# EAGLE design Debug_Phantom_V2 (EAGLE 7.2.0)
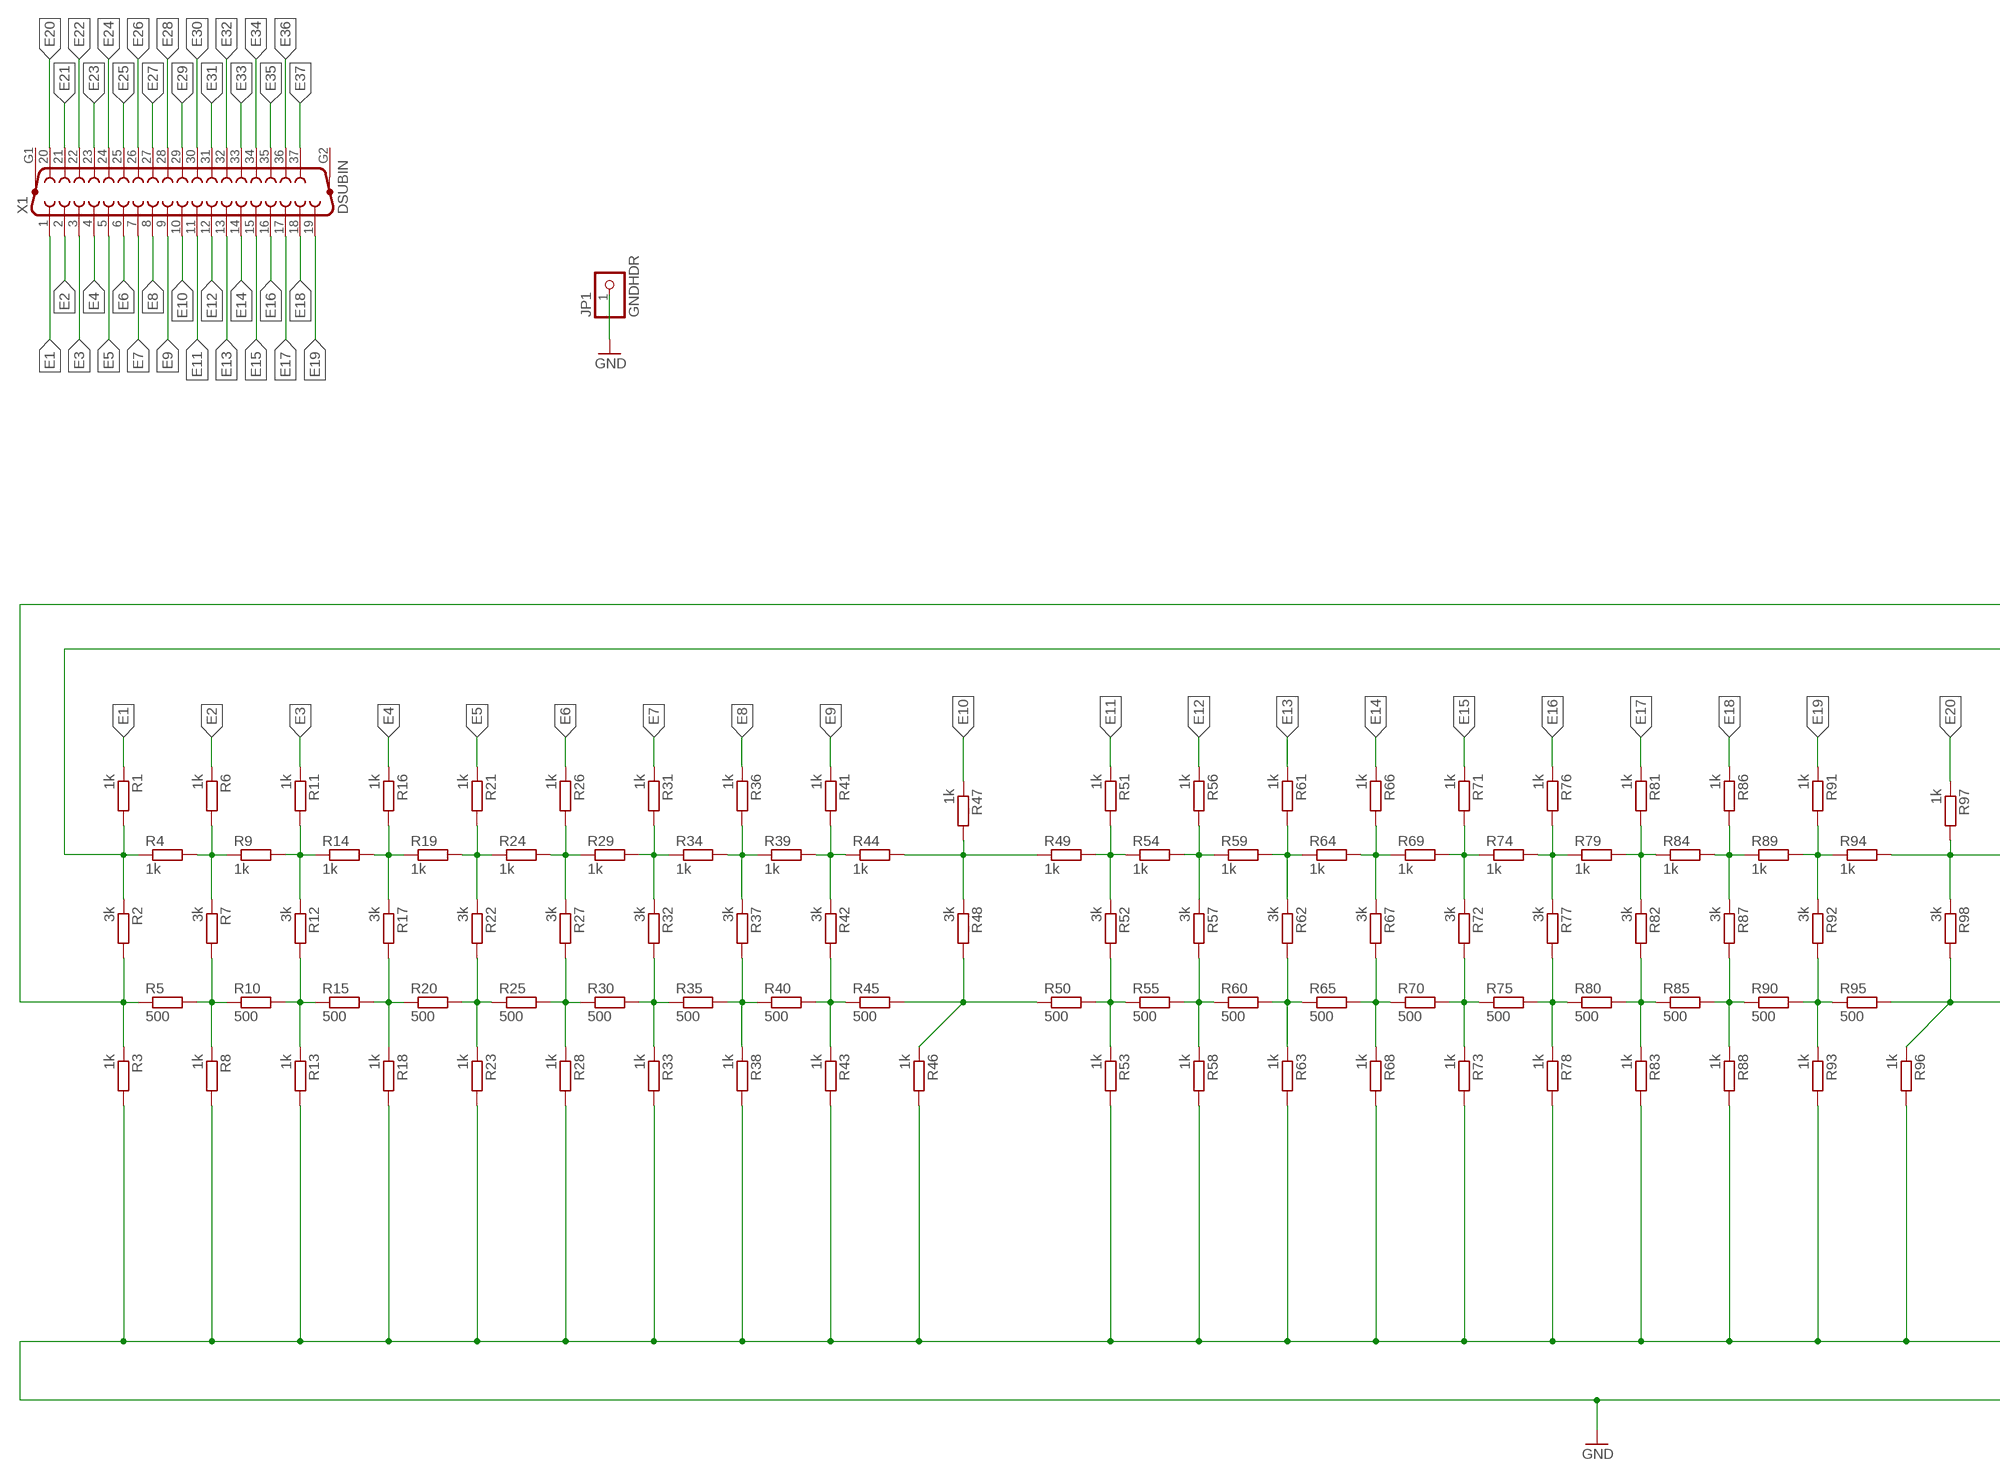
[diagram p0: schematic, sheet 1, part 1 of 2]
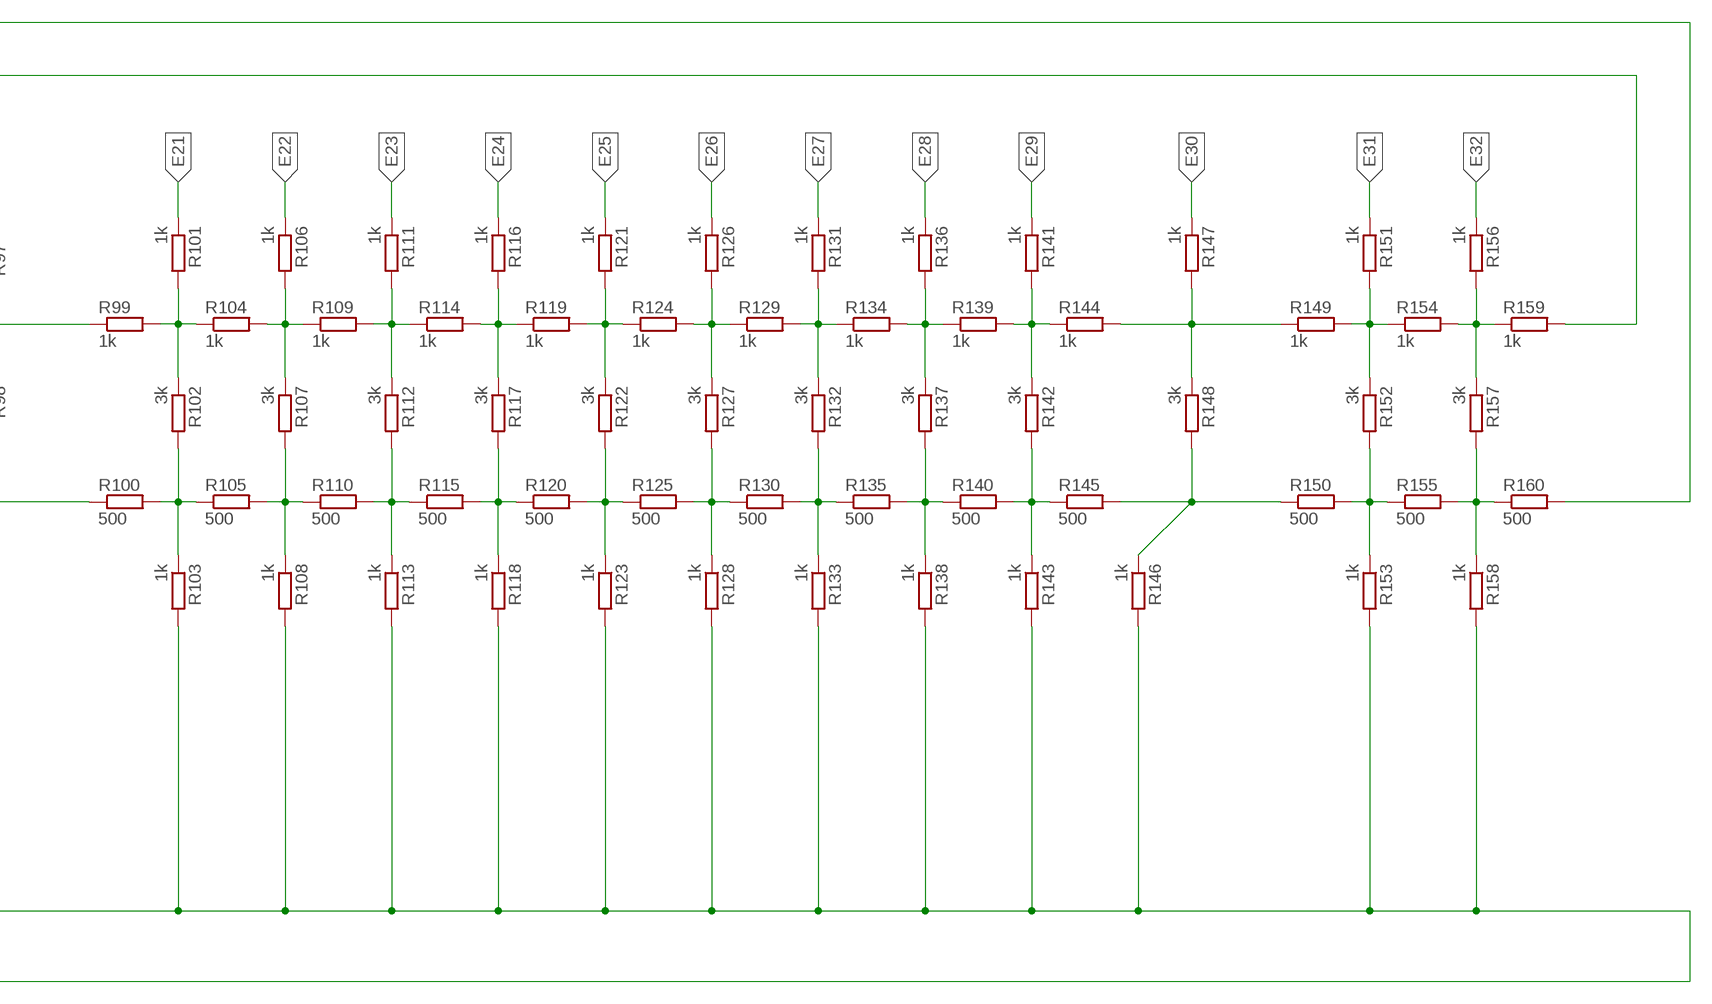
[diagram p1: schematic, sheet 1, part 2 of 2]

## Parts
JP1  GNDHDR  PINHD-1X1  [1X01]
R1  1k  R-EU_R0402  [R0402]
R2  3k  R-EU_R0402  [R0402]
R3  1k  R-EU_R0402  [R0402]
R4  1k  R-EU_R0402  [R0402]
R5  500  R-EU_R0402  [R0402]
R6  1k  R-EU_R0402  [R0402]
R7  3k  R-EU_R0402  [R0402]
R8  1k  R-EU_R0402  [R0402]
R9  1k  R-EU_R0402  [R0402]
R10  500  R-EU_R0402  [R0402]
R11  1k  R-EU_R0402  [R0402]
R12  3k  R-EU_R0402  [R0402]
R13  1k  R-EU_R0402  [R0402]
R14  1k  R-EU_R0402  [R0402]
R15  500  R-EU_R0402  [R0402]
R16  1k  R-EU_R0402  [R0402]
R17  3k  R-EU_R0402  [R0402]
R18  1k  R-EU_R0402  [R0402]
R19  1k  R-EU_R0402  [R0402]
R20  500  R-EU_R0402  [R0402]
R21  1k  R-EU_R0402  [R0402]
R22  3k  R-EU_R0402  [R0402]
R23  1k  R-EU_R0402  [R0402]
R24  1k  R-EU_R0402  [R0402]
R25  500  R-EU_R0402  [R0402]
R26  1k  R-EU_R0402  [R0402]
R27  3k  R-EU_R0402  [R0402]
R28  1k  R-EU_R0402  [R0402]
R29  1k  R-EU_R0402  [R0402]
R30  500  R-EU_R0402  [R0402]
R31  1k  R-EU_R0402  [R0402]
R32  3k  R-EU_R0402  [R0402]
R33  1k  R-EU_R0402  [R0402]
R34  1k  R-EU_R0402  [R0402]
R35  500  R-EU_R0402  [R0402]
R36  1k  R-EU_R0402  [R0402]
R37  3k  R-EU_R0402  [R0402]
R38  1k  R-EU_R0402  [R0402]
R39  1k  R-EU_R0402  [R0402]
R40  500  R-EU_R0402  [R0402]
R41  1k  R-EU_R0402  [R0402]
R42  3k  R-EU_R0402  [R0402]
R43  1k  R-EU_R0402  [R0402]
R44  1k  R-EU_R0402  [R0402]
R45  500  R-EU_R0402  [R0402]
R46  1k  R-EU_R0402  [R0402]
R47  1k  R-EU_R0402  [R0402]
R48  3k  R-EU_R0402  [R0402]
R49  1k  R-EU_R0402  [R0402]
R50  500  R-EU_R0402  [R0402]
R51  1k  R-EU_R0402  [R0402]
R52  3k  R-EU_R0402  [R0402]
R53  1k  R-EU_R0402  [R0402]
R54  1k  R-EU_R0402  [R0402]
R55  500  R-EU_R0402  [R0402]
R56  1k  R-EU_R0402  [R0402]
R57  3k  R-EU_R0402  [R0402]
R58  1k  R-EU_R0402  [R0402]
R59  1k  R-EU_R0402  [R0402]
R60  500  R-EU_R0402  [R0402]
R61  1k  R-EU_R0402  [R0402]
R62  3k  R-EU_R0402  [R0402]
R63  1k  R-EU_R0402  [R0402]
R64  1k  R-EU_R0402  [R0402]
R65  500  R-EU_R0402  [R0402]
R66  1k  R-EU_R0402  [R0402]
R67  3k  R-EU_R0402  [R0402]
R68  1k  R-EU_R0402  [R0402]
R69  1k  R-EU_R0402  [R0402]
R70  500  R-EU_R0402  [R0402]
R71  1k  R-EU_R0402  [R0402]
R72  3k  R-EU_R0402  [R0402]
R73  1k  R-EU_R0402  [R0402]
R74  1k  R-EU_R0402  [R0402]
R75  500  R-EU_R0402  [R0402]
R76  1k  R-EU_R0402  [R0402]
R77  3k  R-EU_R0402  [R0402]
R78  1k  R-EU_R0402  [R0402]
R79  1k  R-EU_R0402  [R0402]
R80  500  R-EU_R0402  [R0402]
R81  1k  R-EU_R0402  [R0402]
R82  3k  R-EU_R0402  [R0402]
R83  1k  R-EU_R0402  [R0402]
R84  1k  R-EU_R0402  [R0402]
R85  500  R-EU_R0402  [R0402]
R86  1k  R-EU_R0402  [R0402]
R87  3k  R-EU_R0402  [R0402]
R88  1k  R-EU_R0402  [R0402]
R89  1k  R-EU_R0402  [R0402]
R90  500  R-EU_R0402  [R0402]
R91  1k  R-EU_R0402  [R0402]
R92  3k  R-EU_R0402  [R0402]
R93  1k  R-EU_R0402  [R0402]
R94  1k  R-EU_R0402  [R0402]
R95  500  R-EU_R0402  [R0402]
R96  1k  R-EU_R0402  [R0402]
R97  1k  R-EU_R0402  [R0402]
R98  3k  R-EU_R0402  [R0402]
R99  1k  R-EU_R0402  [R0402]
R100  500  R-EU_R0402  [R0402]
R101  1k  R-EU_R0402  [R0402]
R102  3k  R-EU_R0402  [R0402]
R103  1k  R-EU_R0402  [R0402]
R104  1k  R-EU_R0402  [R0402]
R105  500  R-EU_R0402  [R0402]
R106  1k  R-EU_R0402  [R0402]
R107  3k  R-EU_R0402  [R0402]
R108  1k  R-EU_R0402  [R0402]
R109  1k  R-EU_R0402  [R0402]
R110  500  R-EU_R0402  [R0402]
R111  1k  R-EU_R0402  [R0402]
R112  3k  R-EU_R0402  [R0402]
R113  1k  R-EU_R0402  [R0402]
R114  1k  R-EU_R0402  [R0402]
R115  500  R-EU_R0402  [R0402]
R116  1k  R-EU_R0402  [R0402]
R117  3k  R-EU_R0402  [R0402]
R118  1k  R-EU_R0402  [R0402]
R119  1k  R-EU_R0402  [R0402]
R120  500  R-EU_R0402  [R0402]
R121  1k  R-EU_R0402  [R0402]
R122  3k  R-EU_R0402  [R0402]
R123  1k  R-EU_R0402  [R0402]
R124  1k  R-EU_R0402  [R0402]
R125  500  R-EU_R0402  [R0402]
R126  1k  R-EU_R0402  [R0402]
R127  3k  R-EU_R0402  [R0402]
R128  1k  R-EU_R0402  [R0402]
R129  1k  R-EU_R0402  [R0402]
R130  500  R-EU_R0402  [R0402]
R131  1k  R-EU_R0402  [R0402]
R132  3k  R-EU_R0402  [R0402]
R133  1k  R-EU_R0402  [R0402]
R134  1k  R-EU_R0402  [R0402]
R135  500  R-EU_R0402  [R0402]
R136  1k  R-EU_R0402  [R0402]
R137  3k  R-EU_R0402  [R0402]
R138  1k  R-EU_R0402  [R0402]
R139  1k  R-EU_R0402  [R0402]
R140  500  R-EU_R0402  [R0402]
R141  1k  R-EU_R0402  [R0402]
R142  3k  R-EU_R0402  [R0402]
R143  1k  R-EU_R0402  [R0402]
R144  1k  R-EU_R0402  [R0402]
R145  500  R-EU_R0402  [R0402]
R146  1k  R-EU_R0402  [R0402]
R147  1k  R-EU_R0402  [R0402]
R148  3k  R-EU_R0402  [R0402]
R149  1k  R-EU_R0402  [R0402]
R150  500  R-EU_R0402  [R0402]
R151  1k  R-EU_R0402  [R0402]
R152  3k  R-EU_R0402  [R0402]
R153  1k  R-EU_R0402  [R0402]
R154  1k  R-EU_R0402  [R0402]
R155  500  R-EU_R0402  [R0402]
R156  1k  R-EU_R0402  [R0402]
R157  3k  R-EU_R0402  [R0402]
R158  1k  R-EU_R0402  [R0402]
R159  1k  R-EU_R0402  [R0402]
R160  500  R-EU_R0402  [R0402]
X1  DSUBIN  F37VP  [F37VP]

## Nets
E1: R1.1 X1.1
E2: R6.1 X1.2
E3: R11.1 X1.3
E4: R16.1 X1.4
E5: R21.1 X1.5
E6: R26.1 X1.6
E7: R31.1 X1.7
E8: R36.1 X1.8
E9: R41.1 X1.9
E10: R47.1 X1.10
E11: R51.1 X1.11
E12: R56.1 X1.12
E13: R61.1 X1.13
E14: R66.1 X1.14
E15: R71.1 X1.15
E16: R76.1 X1.16
E17: R81.1 X1.17
E18: R86.1 X1.18
E19: R91.1 X1.19
E20: R97.1 X1.20
E21: R101.1 X1.21
E22: R106.1 X1.22
E23: R111.1 X1.23
E24: R116.1 X1.24
E25: R121.1 X1.25
E26: R126.1 X1.26
E27: R131.1 X1.27
E28: R136.1 X1.28
E29: R141.1 X1.29
E30: R147.1 X1.30
E31: R151.1 X1.31
E32: R156.1 X1.32
E33: X1.33
E34: X1.34
E35: X1.35
E36: X1.36
E37: X1.37
E38: R1.2 R2.1 R4.1 R159.2
E39: R4.2 R6.2 R7.1 R9.1
E40: R9.2 R11.2 R12.1 R14.1
E41: R14.2 R16.2 R17.1 R19.1
E42: R19.2 R21.2 R22.1 R24.1
E43: R24.2 R26.2 R27.1 R29.1
E44: R29.2 R31.2 R32.1 R34.1
E45: R34.2 R36.2 R37.1 R39.1
E46: R39.2 R41.2 R42.1 R44.1
E47: R44.2 R47.2 R48.1 R49.1
E48: R49.2 R51.2 R52.1 R54.1
E49: R54.2 R56.2 R57.1 R59.1
E50: R59.2 R61.2 R62.1 R64.1
E51: R64.2 R66.2 R67.1 R69.1
E52: R69.2 R71.2 R72.1 R74.1
E53: R74.2 R76.2 R77.1 R79.1
E54: R79.2 R81.2 R82.1 R84.1
E55: R84.2 R86.2 R87.1 R89.1
E56: R89.2 R91.2 R92.1 R94.1
E57: R94.2 R97.2 R98.1 R99.1
E58: R99.2 R101.2 R102.1 R104.1
E59: R104.2 R106.2 R107.1 R109.1
E60: R109.2 R111.2 R112.1 R114.1
E61: R114.2 R116.2 R117.1 R119.1
E63: R124.2 R126.2 R127.1 R129.1
E64: R129.2 R131.2 R132.1 R134.1
E65: R134.2 R136.2 R137.1 R139.1
E66: R139.2 R141.2 R142.1 R144.1
E67: R144.2 R147.2 R148.1 R149.1
E68: R149.2 R151.2 R152.1 R154.1
E69: R154.2 R156.2 R157.1 R159.1
GND: JP1.1 R3.2 R8.2 R13.2 R18.2 R23.2 R28.2 R33.2 R38.2 R43.2 R46.2 R53.2 R58.2 R63.2 R68.2 R73.2 R78.2 R83.2 R88.2 R93.2 R96.2 R103.2 R108.2 R113.2 R118.2 R123.2 R128.2 R133.2 R138.2 R143.2 R146.2 R153.2 R158.2
N$1: R119.2 R121.2 R122.1 R124.1
N$2: R2.2 R3.1 R5.1 R160.2
N$3: R5.2 R7.2 R8.1 R10.1
N$4: R10.2 R12.2 R13.1 R15.1
N$5: R15.2 R17.2 R18.1 R20.1
N$6: R20.2 R22.2 R23.1 R25.1
N$7: R25.2 R27.2 R28.1 R30.1
N$8: R30.2 R32.2 R33.1 R35.1
N$9: R35.2 R37.2 R38.1 R40.1
N$10: R40.2 R42.2 R43.1 R45.1
N$12: R50.2 R52.2 R53.1 R55.1
N$13: R55.2 R57.2 R58.1 R60.1
N$14: R60.2 R62.2 R63.1 R65.1
N$15: R65.2 R67.2 R68.1 R70.1
N$16: R70.2 R72.2 R73.1 R75.1
N$17: R75.2 R77.2 R78.1 R80.1
N$18: R80.2 R82.2 R83.1 R85.1
N$19: R85.2 R87.2 R88.1 R90.1
N$20: R90.2 R92.2 R93.1 R95.1
N$22: R100.2 R102.2 R103.1 R105.1
N$23: R105.2 R107.2 R108.1 R110.1
N$24: R110.2 R112.2 R113.1 R115.1
N$25: R115.2 R117.2 R118.1 R120.1
N$26: R120.2 R122.2 R123.1 R125.1
N$28: R125.2 R127.2 R128.1 R130.1
N$29: R130.2 R132.2 R133.1 R135.1
N$30: R135.2 R137.2 R138.1 R140.1
N$31: R140.2 R142.2 R143.1 R145.1
N$33: R150.2 R152.2 R153.1 R155.1
N$34: R155.2 R157.2 R158.1 R160.1
SW_IN1: R45.2 R46.1 R48.2 R50.1
SW_IN2: R95.2 R96.1 R98.2 R100.1
SW_IN3: R145.2 R146.1 R148.2 R150.1
Unconnected: X1.G1 X1.G2

## Library data of the parts
JP1 = pinhead:PINHD-1X1: PIN HEADER
R1-R160 = rcl:R-EU_: RESISTOR, European symbol
X1 = con-subd:F37VP: SUB-D; OC_FARNELL: unknown; OC_NEWARK: unknown

## Board
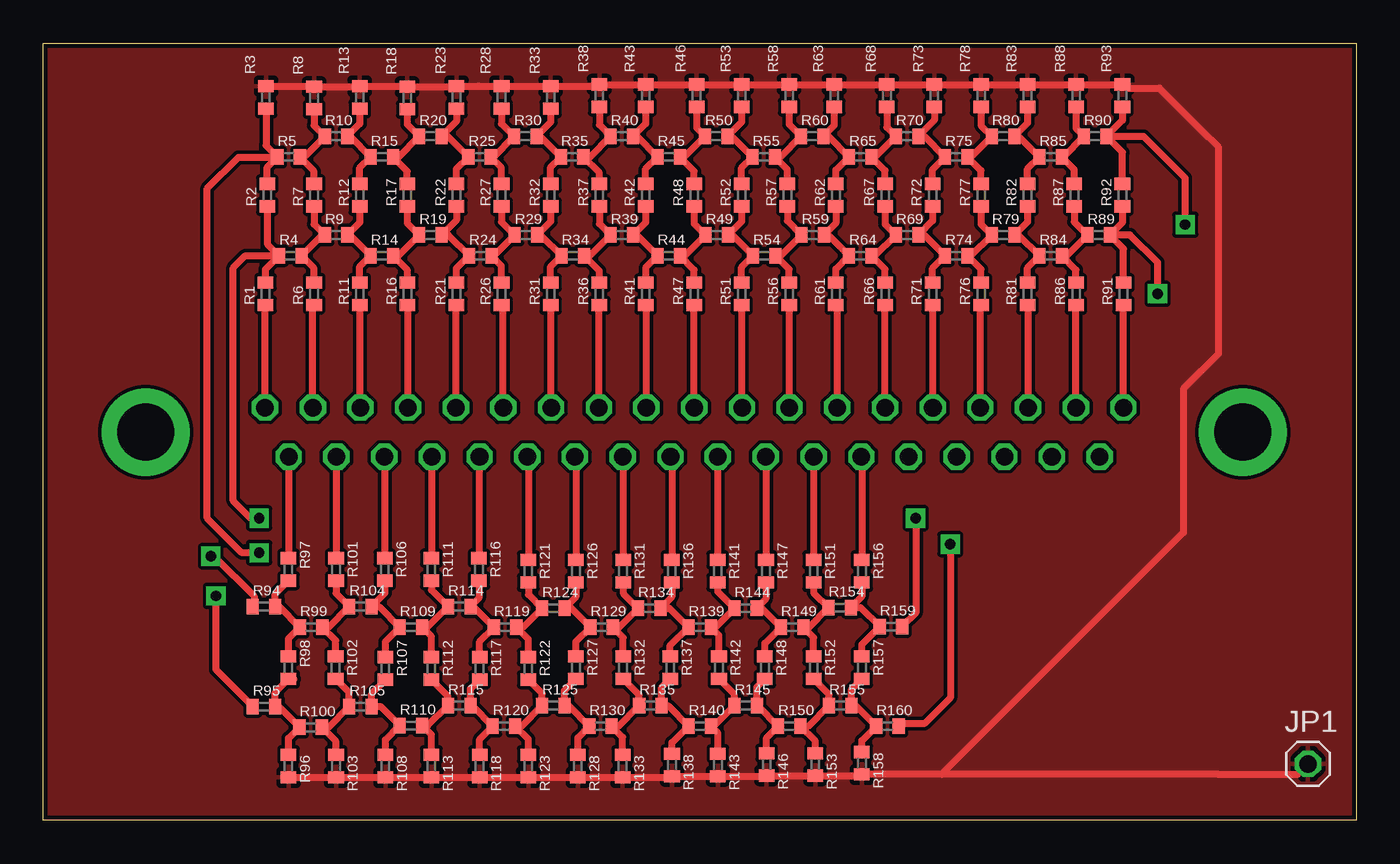
[diagram p2: board, top side]
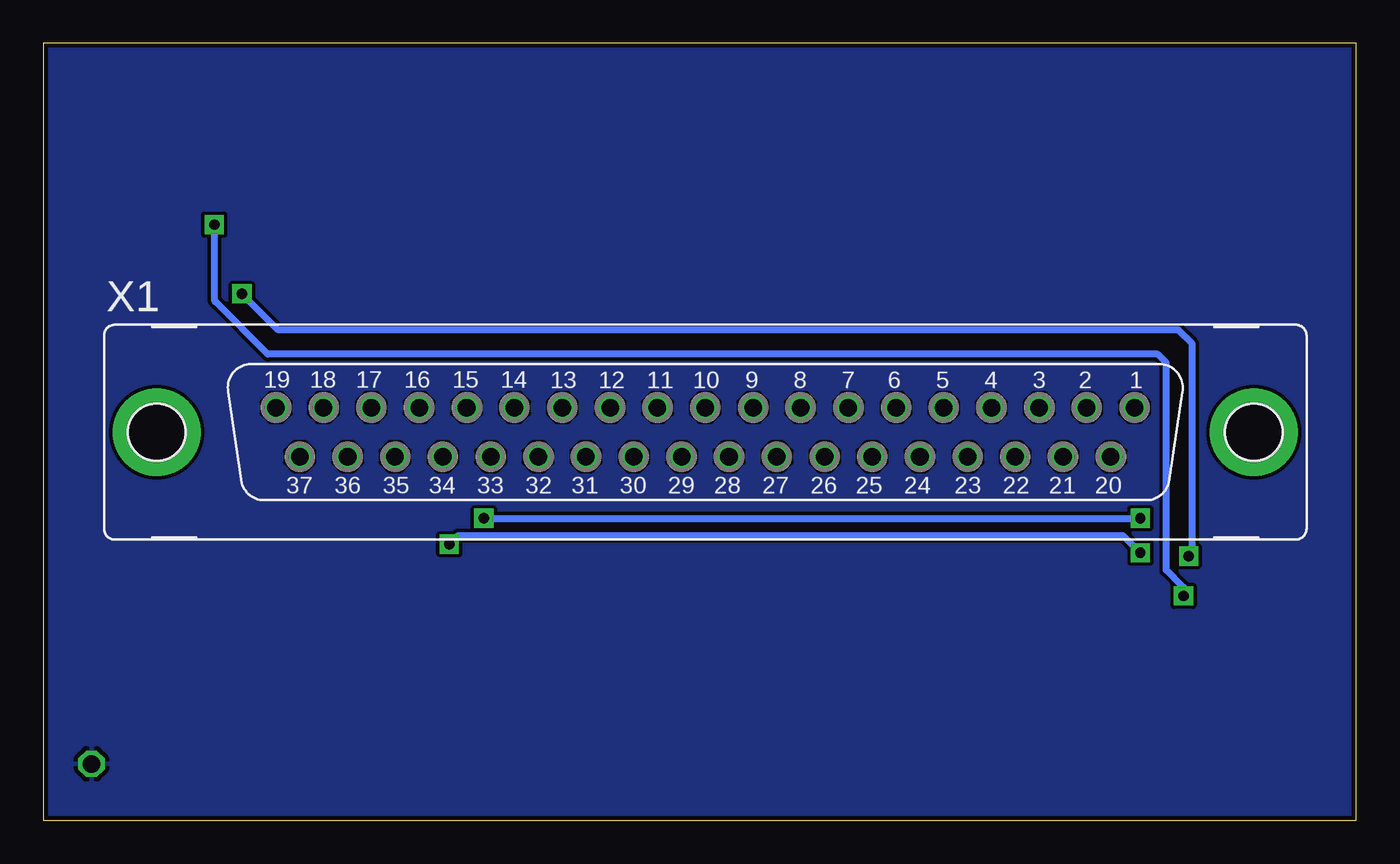
[diagram p3: board, bottom side, seen from below]

Size 76 x 45 mm. Coordinates in mm from the lower left corner, seen from the top.
Outline: 0,45 76,45 76,0 0,0 0,45
Copper layers (1*16): Top 0.035mm / dielectric 1.5mm / Bottom 0.035mm
Design rules "pcbtrain": minimum track width 0.2mm, minimum drill 0.4mm, track to track 0.2mm, track to pad 0.2mm, pad to pad 0.2mm, via to via 0.2mm, smd to smd 0mil, copper to edge 10mil, drill to drill 0.2mm, minimum pad ring 10mil, minimum via ring 10mil, stop-mask expansion 0.125mm, vias tented up to drill 0mil, thermal gap 10mil

### Footprints (pad centres in the part's own frame; a part is rotated, then mirrored left to right if it is on the bottom)
1X01 = drill 1.016 octagon: 1 0,0
R0402 = smd 0.7 x 0.9: 1 -0.65,0; 2 0.65,0
F37VP = drill 1.016 octagon: 1 24.841,1.422; 2 22.073,1.422; 3 19.329,1.422; 4 16.561,1.422; 5 13.792,1.422; 6 11.049,1.422; 7 8.28,1.422; 8 5.512,1.422; 9 2.769,1.422; 10 0,1.422; 11 -2.769,1.422; 12 -5.512,1.422; 13 -8.28,1.422; 14 -11.049,1.422; 15 -13.818,1.422; 16 -16.561,1.422; 17 -19.329,1.422; 18 -22.098,1.422; 19 -24.841,1.422; 20 23.47,-1.422; 21 20.701,-1.422; 22 17.932,-1.422; 23 15.189,-1.422; 24 12.421,-1.422; 25 9.652,-1.422; 26 6.909,-1.422; 27 4.14,-1.422; 28 1.372,-1.422; 29 -1.372,-1.422; 30 -4.14,-1.422; 31 -6.909,-1.422; 32 -9.677,-1.422; 33 -12.421,-1.422; 34 -15.189,-1.422; 35 -17.958,-1.422; 36 -20.701,-1.422; 37 -23.47,-1.422 | drill 3.302 pad 5.08: G1 -31.75,0; G2 31.75,0

### Placement (x,y rotation side)
JP1  73.21,3.28 0 top
R1  12.87,30.5 90 top
R2  12.97,36.2 90 top
R3  12.9,41.86 90 top
R4  14.31,32.69 0 top
R5  14.21,38.41 0 top
R6  15.68,30.5 90 top
R7  15.68,36.2 90 top
R8  15.68,41.82 90 top
R9  16.95,33.89 0 top
R10  16.95,39.61 0 top
R11  18.33,30.5 90 top
R12  18.33,36.2 90 top
R13  18.33,41.86 90 top
R14  19.6,32.69 0 top
R15  19.6,38.41 0 top
R16  21.09,30.5 90 top
R17  21.07,36.2 90 top
R18  21.07,41.82 90 top
R19  22.41,33.89 0 top
R20  22.41,39.61 0 top
R21  23.92,30.48 90 top
R22  23.92,36.2 90 top
R23  23.92,41.86 90 top
R24  25.29,32.69 0 top
R25  25.26,38.41 0 top
R26  26.53,30.48 90 top
R27  26.53,36.2 90 top
R28  26.53,41.86 90 top
R29  27.94,33.89 0 top
R30  27.9,39.61 0 top
R31  29.38,30.48 90 top
R32  29.38,36.2 90 top
R33  29.38,41.86 90 top
R34  30.65,32.69 0 top
R35  30.61,38.41 0 top
R36  32.19,30.48 90 top
R37  32.19,36.2 90 top
R38  32.19,41.96 90 top
R39  33.5,33.89 0 top
R40  33.5,39.61 0 top
R41  34.87,30.48 90 top
R42  34.87,36.2 90 top
R43  34.87,41.96 90 top
R44  36.21,32.69 0 top
R45  36.21,38.41 0 top
R46  37.81,41.96 90 top
R47  37.68,30.48 90 top
R48  37.68,36.2 90 top
R49  38.99,33.89 0 top
R50  38.95,39.61 0 top
R51  40.42,30.48 90 top
R52  40.42,36.2 90 top
R53  40.42,41.96 90 top
R54  41.73,32.69 0 top
R55  41.7,38.41 0 top
R56  43.17,30.48 90 top
R57  43.07,36.2 90 top
R58  43.17,41.96 90 top
R59  44.54,33.89 0 top
R60  44.51,39.61 0 top
R61  45.88,30.48 90 top
R62  45.88,36.2 90 top
R63  45.78,41.96 90 top
R64  47.29,32.69 0 top
R65  47.29,38.41 0 top
R66  48.73,30.48 90 top
R67  48.73,36.2 90 top
R68  48.83,41.96 90 top
R69  50,33.89 0 top
R70  50,39.61 0 top
R71  51.47,30.48 90 top
R72  51.47,36.2 90 top
R73  51.57,41.96 90 top
R74  52.85,32.69 0 top
R75  52.85,38.41 0 top
R76  54.28,30.48 90 top
R77  54.28,36.2 90 top
R78  54.28,41.96 90 top
R79  55.56,33.89 0 top
R80  55.56,39.61 0 top
R81  56.97,30.48 90 top
R82  56.97,36.2 90 top
R83  56.97,41.96 90 top
R84  58.3,32.69 0 top
R85  58.3,38.41 0 top
R86  59.78,30.48 90 top
R87  59.68,36.2 90 top
R88  59.78,41.96 90 top
R89  61.09,33.89 0 top
R90  60.89,39.61 0 top
R91  62.52,30.48 90 top
R92  62.46,36.2 90 top
R93  62.46,41.96 90 top
R94  12.78,12.39 0 top
R95  12.78,6.6 0 top
R96  14.2,3.15 270 top
R97  14.2,14.54 270 top
R98  14.2,8.84 270 top
R99  15.51,11.19 0 top
R100  15.48,5.4 0 top
R101  16.95,14.54 270 top
R102  16.93,8.84 270 top
R103  16.95,3.15 270 top
R104  18.36,12.39 0 top
R105  18.36,6.6 0 top
R106  19.77,14.54 270 top
R107  19.81,8.81 270 top
R108  19.81,3.15 270 top
R109  21.28,11.19 0 top
R110  21.28,5.5 0 top
R111  22.47,14.54 270 top
R112  22.47,8.81 270 top
R113  22.47,3.15 270 top
R114  24.08,12.39 0 top
R115  24.08,6.66 0 top
R116  25.22,14.54 270 top
R117  25.26,8.81 270 top
R118  25.26,3.15 270 top
R119  26.73,11.19 0 top
R120  26.67,5.46 0 top
R121  28.08,14.44 270 top
R122  28.08,8.81 270 top
R123  28.08,3.15 270 top
R124  29.52,12.29 0 top
R125  29.52,6.66 0 top
R126  30.83,14.44 270 top
R127  30.83,8.84 270 top
R128  30.94,3.15 270 top
R129  32.32,11.19 0 top
R130  32.25,5.46 0 top
R131  33.56,14.44 270 top
R132  33.56,8.84 270 top
R133  33.54,3.15 270 top
R134  35.07,12.29 0 top
R135  35.15,6.66 0 top
R136  36.38,14.44 270 top
R137  36.29,8.84 270 top
R138  36.39,3.21 270 top
R139  37.99,11.19 0 top
R140  38,5.46 0 top
R141  39.04,14.44 270 top
R142  39.11,8.84 270 top
R143  39.05,3.21 270 top
R144  40.65,12.29 0 top
R145  40.66,6.66 0 top
R146  41.87,3.25 270 top
R147  41.83,14.44 270 top
R148  41.77,8.84 270 top
R149  43.34,11.19 0 top
R150  43.18,5.46 0 top
R151  44.59,14.44 270 top
R152  44.59,8.84 270 top
R153  44.69,3.25 270 top
R154  46.1,12.33 0 top
R155  46.13,6.66 0 top
R156  47.38,14.44 270 top
R157  47.38,8.84 270 top
R158  47.38,3.31 270 top
R159  49.06,11.23 0 top
R160  48.86,5.46 0 top
X1  37.68,22.48 0 bottom

### Tracks (layer width: path | path; a pad name or v marks a point on that pad's centre or on a via)
E1
  Top 0.406: X1.1 12.84,29.82 R1.1
E2
  Top 0.406: X1.2 15.61,29.78 R6.1
E3
  Top 0.406: X1.3 18.35,29.83 R11.1
E4
  Top 0.406: X1.4 21.12,29.82 R16.1
E5
  Top 0.406: X1.5 23.89,29.8 R21.1
E6
  Top 0.406: X1.6 26.63,29.73 R26.1
E7
  Top 0.406: X1.7 29.4,29.81 R31.1
E8
  Top 0.406: X1.8 32.17,29.82 R36.1
E9
  Top 0.406: X1.9 34.91,29.79 R41.1
E10
  Top 0.406: X1.10 R47.1
E11
  Top 0.406: X1.11 40.45,29.81 R51.1
E12
  Top 0.406: X1.12 43.19,29.82 R56.1
E13
  Top 0.406: X1.13 45.96,29.76 R61.1
E14
  Top 0.406: X1.14 R66.1
E15
  Top 0.406: X1.15 51.5,29.81 R71.1
E16
  Top 0.406: X1.16 54.24,29.79 R76.1
E17
  Top 0.406: X1.17 57.01,29.79 R81.1
E18
  Top 0.406: X1.18 R86.1
E19
  Top 0.406: X1.19 R91.1
E20
  Top 0.406: X1.20 14.2,21.05 R97.1
E21
  Top 0.406: X1.21 16.95,21.04 R101.1
E22
  Top 0.406: X1.22 19.77,21.03 R106.1
E23
  Top 0.406: X1.23 22.47,21.04 R111.1
E24
  Top 0.406: X1.24 25.22,21.02 R116.1
E25
  Top 0.406: X1.25 28.08,21.01 R121.1
E26
  Top 0.406: X1.26 30.83,20.99 R126.1
E27
  Top 0.406: X1.27 33.56,21.03 R131.1
E28
  Top 0.406: X1.28 36.38,20.98 R136.1
E29
  Top 0.406: X1.29 39.04,21.05 R141.1
E30
  Top 0.406: X1.30 41.83,21.05 R147.1
E31
  Top 0.406: X1.31 R151.1
E32
  Top 0.406: X1.32 47.38,21.03 R156.1
E38  (via drill 0.6)
  Top 0.406: v12.5,17.5 12,17.5 11,18.5 11,32 11.7,32.7 R4.1 | R1.2 12.87,31.91 R4.1 | R2.1 12.97,33.38 R4.1 | v50.5,17.5 50.5,12.01 R159.2
  Bottom 0.406: v50.5,17.5 v12.5,17.5
E39
  Top 0.406: R6.2 15.68,31.97 R4.2 16.16,33.89 R9.1 15.68,34.52 R7.1
E40
  Top 0.406: R11.2 18.33,32.07 R14.1 17.75,33.89 R9.2 18.33,34.62 R12.1
E41
  Top 0.406: R16.2 21.09,31.86 R14.2 20.56,32.69 R19.1 21.07,34.58 R17.1
E42
  Top 0.406: R21.2 23.92,31.97 R24.1 23.44,33.89 R19.2 23.92,34.75 R22.1
E43
  Top 0.406: R26.2 26.53,32.11 R24.2 26.09,32.69 R29.1 26.53,34.65 R27.1
E44
  Top 0.406: R31.2 29.38,32.07 R34.1 28.8,33.89 R29.2 29.38,34.68 R32.1
E45
  Top 0.406: R36.2 32.19,31.81 R34.2 31.64,32.69 R39.1 32.19,34.55 R37.1
E46
  Top 0.406: R42.1 34.87,34.62 R39.2 34.35,33.89 R44.1 34.87,32.01 R41.2
E47
  Top 0.406: R47.2 37.68,31.87 R44.2 37.14,32.69 R49.1 37.68,34.55 R48.1
E48
  Top 0.406: R51.2 40.42,32.03 R54.1 39.88,33.89 R49.2 40.42,34.68 R52.1
E49
  Top 0.406: R56.2 43.17,31.91 R54.2 42.69,32.69 R59.1 43.07,34.72 R57.1
E50
  Top 0.406: R61.2 45.88,31.94 R64.1 45.44,33.89 R59.2 45.88,34.58 R62.1
E51
  Top 0.406: R66.2 48.73,31.91 R64.2 48.15,32.69 R69.1 48.73,34.52 R67.1
E52
  Top 0.406: R71.2 51.47,31.97 R74.1 51,33.89 R69.2 51.47,34.72 R72.1
E53
  Top 0.406: R76.2 54.28,31.91 R74.2 53.71,32.69 R79.1 54.28,34.52 R77.1
E54
  Top 0.406: R81.2 56.97,32.01 R84.1 56.45,33.89 R79.2 56.97,34.65 R82.1
E55
  Top 0.406: R86.2 59.78,31.87 R84.2 59.24,32.69 R89.1 59.68,34.65 R87.1
E56  (via drill 0.6)
  Top 0.406: v64.5,30.5 64.5,32.3 62.9,33.9 R89.2 | R92.1 62.46,34.62 R89.2 | R91.2 62.52,33.11 R89.2 | v9.7,15.3 9.9,15.3 12.2,13 12.2,12.46 R94.1
  Bottom 0.406: v9.7,15.3 9.5,15.5 9.5,27.6 10.3,28.4 62.4,28.4 v64.5,30.5
E57
  Top 0.406: R97.2 13.43,13.12 R94.2 13.66,12.39 R99.1 14.2,10.53 R98.1
E58
  Top 0.406: R101.2 16.95,13.15 R104.1 16.51,11.19 R99.2 16.93,10.42 R102.1
E59
  Top 0.406: R106.2 19.77,13.15 R104.2 19.43,12.39 R109.1 19.81,10.37 R107.1
E60
  Top 0.406: R111.2 22.47,13.35 R114.1 22.23,11.19 R109.2 22.47,10.66 R112.1
E61
  Top 0.406: R116.2 25.22,12.89 R114.2 24.88,12.39 R119.1 25.26,10.37 R117.1
E63
  Top 0.406: R126.2 30.83,12.95 R124.2 30.57,12.29 R129.1 30.83,10.36 R127.1
E64
  Top 0.406: R131.2 33.56,13.15 R134.1 33.32,11.19 R129.2 33.56,10.59 R132.1
E65
  Top 0.406: R136.2 36.38,12.95 R134.2 36.24,12.29 R139.1 36.29,10.14 R137.1
E66
  Top 0.406: R141.2 39.04,13.25 R144.1 38.9,11.19 R139.2 39.11,10.72 R142.1
E67
  Top 0.406: R147.2 41.83,12.82 R144.2 41.59,12.29 R149.1 41.77,10.27 R148.1
E68
  Top 0.406: R151.2 44.59,13.19 R154.1 44.31,11.19 R149.2 44.59,10.59 R152.1
E69
  Top 0.406: R156.2 47.38,12.96 R154.2 47.31,12.33 R159.1 47.38,10.19 R157.1
GND
  Top 0.406: R3.2 15.64,42.51 R8.2 18.29,42.47 R13.2 21.04,42.51 R18.2 23.88,42.47 R23.2 25.2,42.51 R28.2 R33.2 32.09,42.51 R38.2 R43.2 R46.2 R53.2 R58.2 R63.2 R68.2 R73.2 R78.2 R83.2 R88.2 R93.2 62.67,42.4 64.6,42.4 67,40 68,39 68,27 66,25 66,16.66 52,2.66 | 52,2.66 68.04,2.66 72.59,2.66 JP1.1 | 52,2.66 R158.2 47.32,2.6 R153.2 R146.2 41.83,2.56 R143.2 R138.2 36.33,2.5 35,2.5 R133.2 R128.2 R123.2 R118.2 R113.2 R108.2 R103.2 R96.2
  pour Top: -3,45 79,45 79,0 -3,0
  pour Bottom: -4,46 80,46 80,-1 -4,-1
N$1
  Top 0.406: R121.2 28.08,13.09 R124.1 27.78,11.19 R119.2 28.08,10.49 R122.1
N$2  (via drill 0.6)
  Top 0.406: v12.5,15.5 11.5,15.5 9.5,17.5 9.5,36.6 11.3,38.4 13.54,38.4 R5.1 | R2.2 12.97,37.83 R5.1 | R3.1 12.9,39.07 R5.1 | v52.5,16 52.5,7.1 51,5.6 49.65,5.6 R160.2
  Bottom 0.406: v52.5,16 52,16.5 13.5,16.5 v12.5,15.5
N$3
  Top 0.406: R7.2 15.68,37.59 R5.2 15.1,38.41 R10.1 15.68,40.24 R8.1
N$4
  Top 0.406: R12.2 18.33,37.79 R15.1 17.75,39.61 R10.2 18.33,40.34 R13.1
N$5
  Top 0.406: R17.2 21.07,37.59 R15.2 20.56,38.41 R20.1 21.07,40.3 R18.1
N$6
  Top 0.406: R22.2 23.92,37.73 R25.1 23.41,39.61 R20.2 23.92,40.47 R23.1
N$7
  Top 0.406: R27.2 26.53,37.79 R25.2 26.05,38.41 R30.1 26.53,40.34 R28.1
N$8
  Top 0.406: R32.2 29.38,37.83 R35.1 28.76,39.61 R30.2 29.38,40.44 R33.1
N$9
  Top 0.406: R37.2 32.19,37.49 R35.2 31.64,38.41 R40.1 32.19,40.27 R38.1
N$10
  Top 0.406: R42.2 34.87,37.73 R45.1 34.35,39.61 R40.2 34.87,40.34 R43.1
N$12
  Top 0.406: R52.2 40.42,37.79 R55.1 39.85,39.61 R50.2 40.42,40.44 R53.1
N$13
  Top 0.406: R57.2 43.07,37.69 R55.2 42.66,38.41 R60.1 43.17,40.3 R58.1
N$14
  Top 0.406: R62.2 45.88,37.65 R65.1 45.44,39.61 R60.2 45.78,40.24 R63.1
N$15
  Top 0.406: R67.2 48.73,37.63 R65.2 48.15,38.41 R70.1 48.83,40.14 R68.1
N$16
  Top 0.406: R72.2 51.47,37.69 R75.1 51,39.61 R70.2 51.57,40.54 R73.1
N$17
  Top 0.406: R77.2 54.28,37.63 R75.2 53.71,38.41 R80.1 54.28,40.24 R78.1
N$18
  Top 0.406: R82.2 56.97,37.73 R85.1 56.45,39.61 R80.2 56.97,40.37 R83.1
N$19
  Top 0.406: R87.2 59.68,37.69 R85.2 59.04,38.41 R90.1 59.78,40.07 R88.1
N$20  (via drill 0.6)
  Top 0.406: v10,13 10,8.73 R95.1 | R92.2 62.46,38.69 R90.2 | R93.1 62.46,40.54 R90.2 | v66.1,34.5 66.1,37.2 63.7,39.6 R90.2
  Bottom 0.406: v10,13 10,13.5 11,14.5 11,26.5 11.5,27 63,27 66,30 66.1,30.1 v66.1,34.5
N$22
  Top 0.406: R102.2 17.71,7.41 R105.1 16.51,5.4 R100.2 16.95,4.57 R103.1
N$23
  Top 0.406: R107.2 19.01,7.36 R105.2 19.53,6.6 R110.1 19.81,4.67 R108.1
N$24
  Top 0.406: R112.2 23.43,7.2 R115.1 22.26,5.5 R110.2 22.47,4.96 R113.1
N$25
  Top 0.406: R117.2 24.73,7.62 R115.2 24.82,6.66 R120.1 25.26,4.7 R118.1
N$26
  Top 0.406: R122.2 28.88,7.36 R125.1 27.67,5.46 R120.2 28.08,4.7 R123.1
N$28
  Top 0.406: R127.2 30.17,7.53 R125.2 30.4,6.66 R130.1 30.94,4.8 R128.1
N$29
  Top 0.406: R132.2 34.5,7.26 R135.1 33.3,5.46 R130.2 33.54,4.83 R133.1
N$30
  Top 0.406: R137.2 35.8,7.7 R135.2 36.15,6.66 R140.1 36.39,4.5 R138.1
N$31
  Top 0.406: R142.2 40.01,7.3 R145.1 38.81,5.46 R140.2 39.05,5.06 R143.1
N$33
  Top 0.406: R152.2 45.48,7.3 R155.1 44.28,5.46 R150.2 44.69,4.6 R153.1
N$34
  Top 0.406: R157.2 46.78,7.6 R155.2 47.01,6.66 R160.1 47.38,4.63 R158.1
SW_IN1
  Top 0.406: R48.2 37.68,37.59 R45.2 37.1,38.41 R50.1 37.81,40.1 R46.1
SW_IN2
  Top 0.406: R96.1 14.2,4.76 R100.1 13.63,6.6 R95.2 13.43,7.42 R98.2 14.51,8.19
SW_IN3
  Top 0.406: R148.2 41.31,7.73 R145.2 41.33,6.66 R150.1 41.87,4.8 R146.1

### Text on the board
tText: Gnd | Gnd | DEBUG PHANTOM V2 | Gnd
bText: Gnd | Gnd